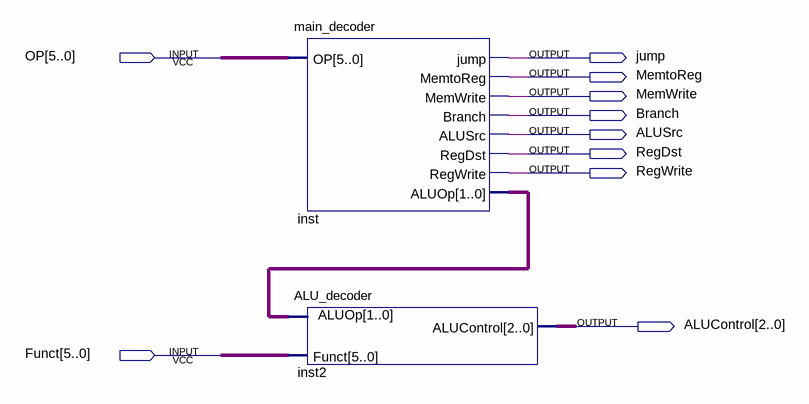
[diagram p0: schematic sheet]
// Quartus schematic control_unit.bdf as structural Verilog: 2 symbols, 10 pins
module control_unit (
  input  [5:0] OP,
  input  [5:0] Funct,
  output jump,
  output MemtoReg,
  output MemWrite,
  output Branch,
  output ALUSrc,
  output RegDst,
  output RegWrite,
  output [2:0] ALUControl
);

  wire [1:0] inst_aluop;

  main_decoder inst (
    .OP(OP), .jump(jump), .MemtoReg(MemtoReg), .MemWrite(MemWrite), .Branch(Branch), .ALUSrc(ALUSrc),
    .RegDst(RegDst), .RegWrite(RegWrite), .ALUOp(inst_aluop));
  ALU_decoder inst2 (.Funct(Funct), .ALUOp(inst_aluop), .ALUControl(ALUControl));
endmodule
